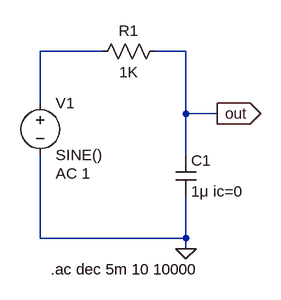
[diagram p0: schematic Practica 2-2.asc]
Practica 2-2.asc, the LTspice schematic file:
Version 4
SHEET 1 880 680
WIRE 160 -16 64 -16
WIRE 288 -16 240 -16
WIRE 64 64 64 -16
WIRE 288 80 288 -16
WIRE 336 80 288 80
WIRE 288 144 288 80
WIRE 64 272 64 144
WIRE 288 272 288 208
WIRE 288 272 64 272
WIRE 288 288 288 272
FLAG 288 288 0
FLAG 336 80 out
IOPIN 336 80 Out
SYMBOL res 256 -32 R90
WINDOW 0 0 56 VBottom 2
WINDOW 3 32 56 VTop 2
SYMATTR InstName R1
SYMATTR Value 1K
SYMATTR SpiceLine tol=1 pwr=0.1
SYMBOL cap 272 144 R0
SYMATTR InstName C1
SYMATTR Value 1μ ic=0
SYMBOL voltage 64 48 R0
WINDOW 123 24 124 Left 2
WINDOW 39 0 0 Left 0
SYMATTR Value2 AC 1
SYMATTR InstName V1
SYMATTR Value SINE()
TEXT 80 320 Left 2 !.ac dec 5m 10 10000

The netlist it stands for:
* Practica 2-2.asc
R1 out N001 1K tol=1 pwr=0.1
C1 out 0 1μ ic=0
V1 N001 0 SINE() AC 1
.ac dec 5m 10 10000
.backanno
.end